# EAGLE schematic LED (EAGLE 8.2.1)
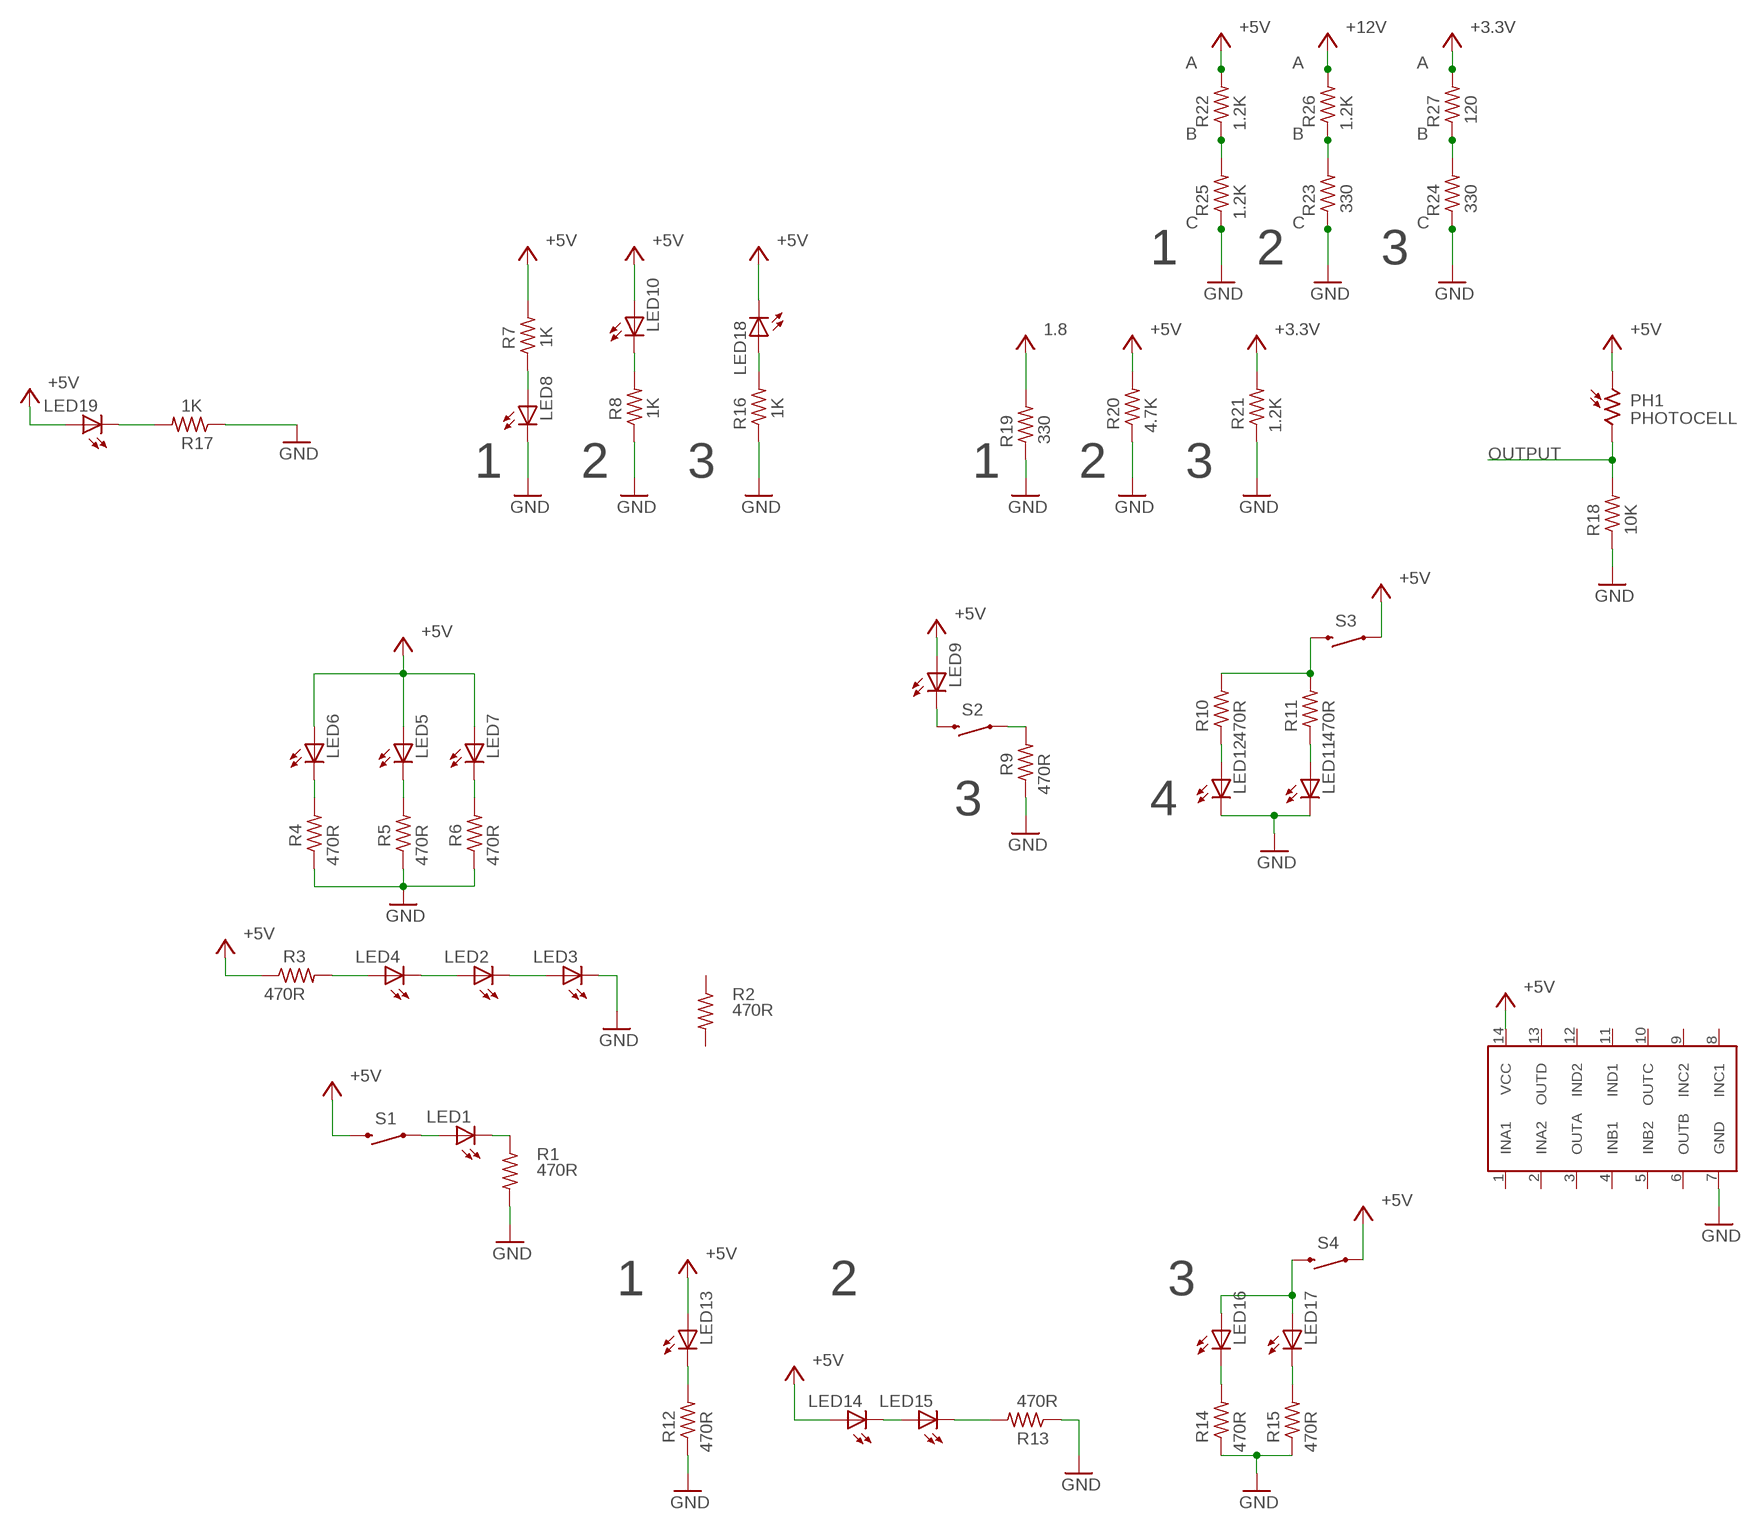
[diagram p0: schematic, sheet 1]

## Parts
LED1  LAP4-BOTTOM  [P47F-BOTTOM]
LED2  LAP4-BOTTOM  [P47F-BOTTOM]
LED3  LAP4-BOTTOM  [P47F-BOTTOM]
LED4  LAP4-BOTTOM  [P47F-BOTTOM]
LED5  LAP4-BOTTOM  [P47F-BOTTOM]
LED6  LAP4-BOTTOM  [P47F-BOTTOM]
LED7  LAP4-BOTTOM  [P47F-BOTTOM]
LED8  LAP4-BOTTOM  [P47F-BOTTOM]
LED9  LAP4-BOTTOM  [P47F-BOTTOM]
LED10  LAP4-BOTTOM  [P47F-BOTTOM]
LED11  LAP4-BOTTOM  [P47F-BOTTOM]
LED12  LAP4-BOTTOM  [P47F-BOTTOM]
LED13  LAP4-BOTTOM  [P47F-BOTTOM]
LED14  LAP4-BOTTOM  [P47F-BOTTOM]
LED15  LAP4-BOTTOM  [P47F-BOTTOM]
LED16  LAP4-BOTTOM  [P47F-BOTTOM]
LED17  LAP4-BOTTOM  [P47F-BOTTOM]
LED18  LAP4-BOTTOM  [P47F-BOTTOM]
LED19  LAP4-BOTTOM  [P47F-BOTTOM]
PH1  PHOTOCELL  PHOTOCELLD11  [D11XX_H]
R1  470R  R-US_0207/12  [0207/12]
R2  470R  R-US_0207/12  [0207/12]
R3  470R  R-US_0207/12  [0207/12]
R4  470R  R-US_0207/12  [0207/12]
R5  470R  R-US_0207/12  [0207/12]
R6  470R  R-US_0207/12  [0207/12]
R7  1K  R-US_0207/12  [0207/12]
R8  1K  R-US_0207/12  [0207/12]
R9  470R  R-US_0207/12  [0207/12]
R10  470R  R-US_0207/12  [0207/12]
R11  470R  R-US_0207/12  [0207/12]
R12  470R  R-US_0207/12  [0207/12]
R13  470R  R-US_0207/12  [0207/12]
R14  470R  R-US_0207/12  [0207/12]
R15  470R  R-US_0207/12  [0207/12]
R16  1K  R-US_0207/12  [0207/12]
R17  1K  R-US_0207/12  [0207/12]
R18  10K  R-US_0207/12  [0207/12]
R19  330  R-US_0207/12  [0207/12]
R20  4.7K  R-US_0207/12  [0207/12]
R21  1.2K  R-US_0207/12  [0207/12]
R22  1.2K  R-US_0207/12  [0207/12]
R23  330  R-US_0207/12  [0207/12]
R24  330  R-US_0207/12  [0207/12]
R25  1.2K  R-US_0207/12  [0207/12]
R26  1.2K  R-US_0207/12  [0207/12]
R27  120  R-US_0207/12  [0207/12]
S1  MOMENTARY-SWITCH-SPST-PTH-6.0MM  [TACTILE_SWITCH_PTH_6.0MM]
S2  MOMENTARY-SWITCH-SPST-PTH-6.0MM  [TACTILE_SWITCH_PTH_6.0MM]
S3  MOMENTARY-SWITCH-SPST-PTH-6.0MM  [TACTILE_SWITCH_PTH_6.0MM]
S4  MOMENTARY-SWITCH-SPST-PTH-6.0MM  [TACTILE_SWITCH_PTH_6.0MM]
U$1  7408  [DIL14]

## Nets
+5V: LED5.A LED6.A LED7.A LED9.A LED10.A LED13.A LED14.A LED18.C LED19.A PH1.1 R3.1 R7.2 R19.2 R20.2 R21.2 R22.2 R26.2 R27.2 S1.3 S3.1 S4.1 U$1.14(VCC) ; supply symbol labelled 1.8, +3.3V, +12V
GND: LED3.C LED8.C LED11.C LED12.C R1.2 R4.1 R5.1 R6.1 R8.1 R9.1 R12.1 R13.1 R14.1 R15.1 R16.1 R17.1 R18.1 R19.1 R20.1 R21.1 R23.1 R24.1 R25.1 U$1.7(GND)
N$1: LED1.A S1.1
N$2: LED1.C R1.1
N$3: LED4.A R3.2
N$4: LED2.A LED4.C
N$5: LED2.C LED3.A
N$6: LED8.A R7.1
N$7: LED6.C R4.2
N$8: LED5.C R5.2
N$9: LED7.C R6.2
N$10: LED10.C R8.2
N$11: LED9.C S2.3
N$12: R9.2 S2.1
N$13: R10.2 R11.2 S3.3
N$14: LED12.A R10.1
N$15: LED11.A R11.1
N$16: LED13.C R12.2
N$17: LED14.C LED15.A
N$18: LED15.C R13.2
N$19: LED18.A R16.2
N$20: LED16.C R14.2
N$21: LED17.C R15.2
N$22: LED16.A LED17.A S4.3
N$23: LED19.C R17.2
N$24: PH1.2 R18.2
N$26: R22.1 R25.2
N$27: R23.2 R26.1
N$28: R24.2 R27.1
Unconnected: R2.1 R2.2 U$1.1(INA1) U$1.2(INA2) U$1.3(OUTA) U$1.4(INB1) U$1.5(INB2) U$1.6(OUTB) U$1.8(INC1) U$1.9(INC2) U$1.10(OUTC) U$1.11(IND1) U$1.12(IND2) U$1.13(OUTD)

## Notes on the sheet
- A | A | A
- B | B | B
- C | C | C
- 1 | 2 | 3
- OUTPUT
- 1 | 2 | 3 | 1 | 2 | 3
- 3 | 4
- 1 | 2 | 3

## Library data of the parts
LED1-LED19 = led:*P4: PointLED® Enhanced Thinfilm LED TOP & BOTTOM mount LS P47F, LR P47F, LA P47F, LY P47F, LT P4SG, LB P4SG, LW P4SG Source: http://catalog.osram-os.com .. LA_LR_LS_LY_P47F_Pb_free.pdf
PH1 = photo-elements:PHOTOCELL: Photo Sensor
R1-R27 = rcl:R-US_: RESISTOR, American symbol
S1-S4 = SparkFun-Switches:MOMENTARY-SWITCH-SPST: Momentary Switch (Pushbutton) - SPST Normally-open (NO) SPST momentary switches (buttons, pushbuttons). Variants PTH-12MM - 12mm square, through-hole Momentary Pushbutton Switch - 12mm Square <https://www.sparkfun.com/products/9190> (COM-09190) PTH-6.0MM, PTH-6.0MM-KIT - 6.0mm square, through-hole Mini Pushbutton Switch <https://www.sparkfun.com/products/97> (COM-00097) KIT package intended for soldering kit's - only one side of pads' copper is exposed. PTH-RIGHT-ANGLE-KIT - Right-angle, through-hole Right Angle Tactile Button <https://www.sparkfun.com/products/10791> - Used on SparkFun BigTime Watch Kit <https://www.sparkfun.com/products/11734> SMD-12MM - 12mm square, surface-mount Tactile Button - SMD (12mm) <https://www.sparkfun.com/products/12993> (COM-12993) Used on SparkFun PicoBoard <https://www.sparkfun.com/products/11888> SMD-4.5MM - 4.5mm Square Trackball Switch Used on SparkFun Blackberry Trackballer Breakout <https://www.sparkfun.com/products/13169> SMD-4.6MMX2.8MM - 4.60mm x 2.80mm, surface mount Used on SparkFun SAMD21 Mini Breakout <https://www.sparkfun.com/products/13664> SMD-5.2MM, SMD-5.2-REDUNDANT - 5.2mm square, surface-mount Mini Pushbutton Switch - SMD <https://www.sparkfun.com/products/8720> (COM-08720) Used on Arduino Pro Mini <https://www.sparkfun.com/products/11114> REDUNDANT package connects both switch circuits together SMD-6.0X3.5MM - 6.0 x 3.5mm, surface mount Momentary Reset Switch SMD <https://www.sparkfun.com/products/8229> (COM-08229) SMD-6.2MM-TALL - 6.2mm square, surface mount Tactile Button - SMD (6mm) <https://www.sparkfun.com/products/12992> Used on SparkFun Digital Sandbox <https://www.sparkfun.com/products/12651> SMD-RIGHT-ANGLE - Right-angle, surface mount Used on SparkFun Block for Intel® Edison - Arduino <https://www.sparkfun.com/products/13036>; PROD_ID: SWCH-08441; SF_SKU: COM-00097
U$1 = MVTHS:7408